# EAGLE design atarimovie (EAGLE 8.7.1)
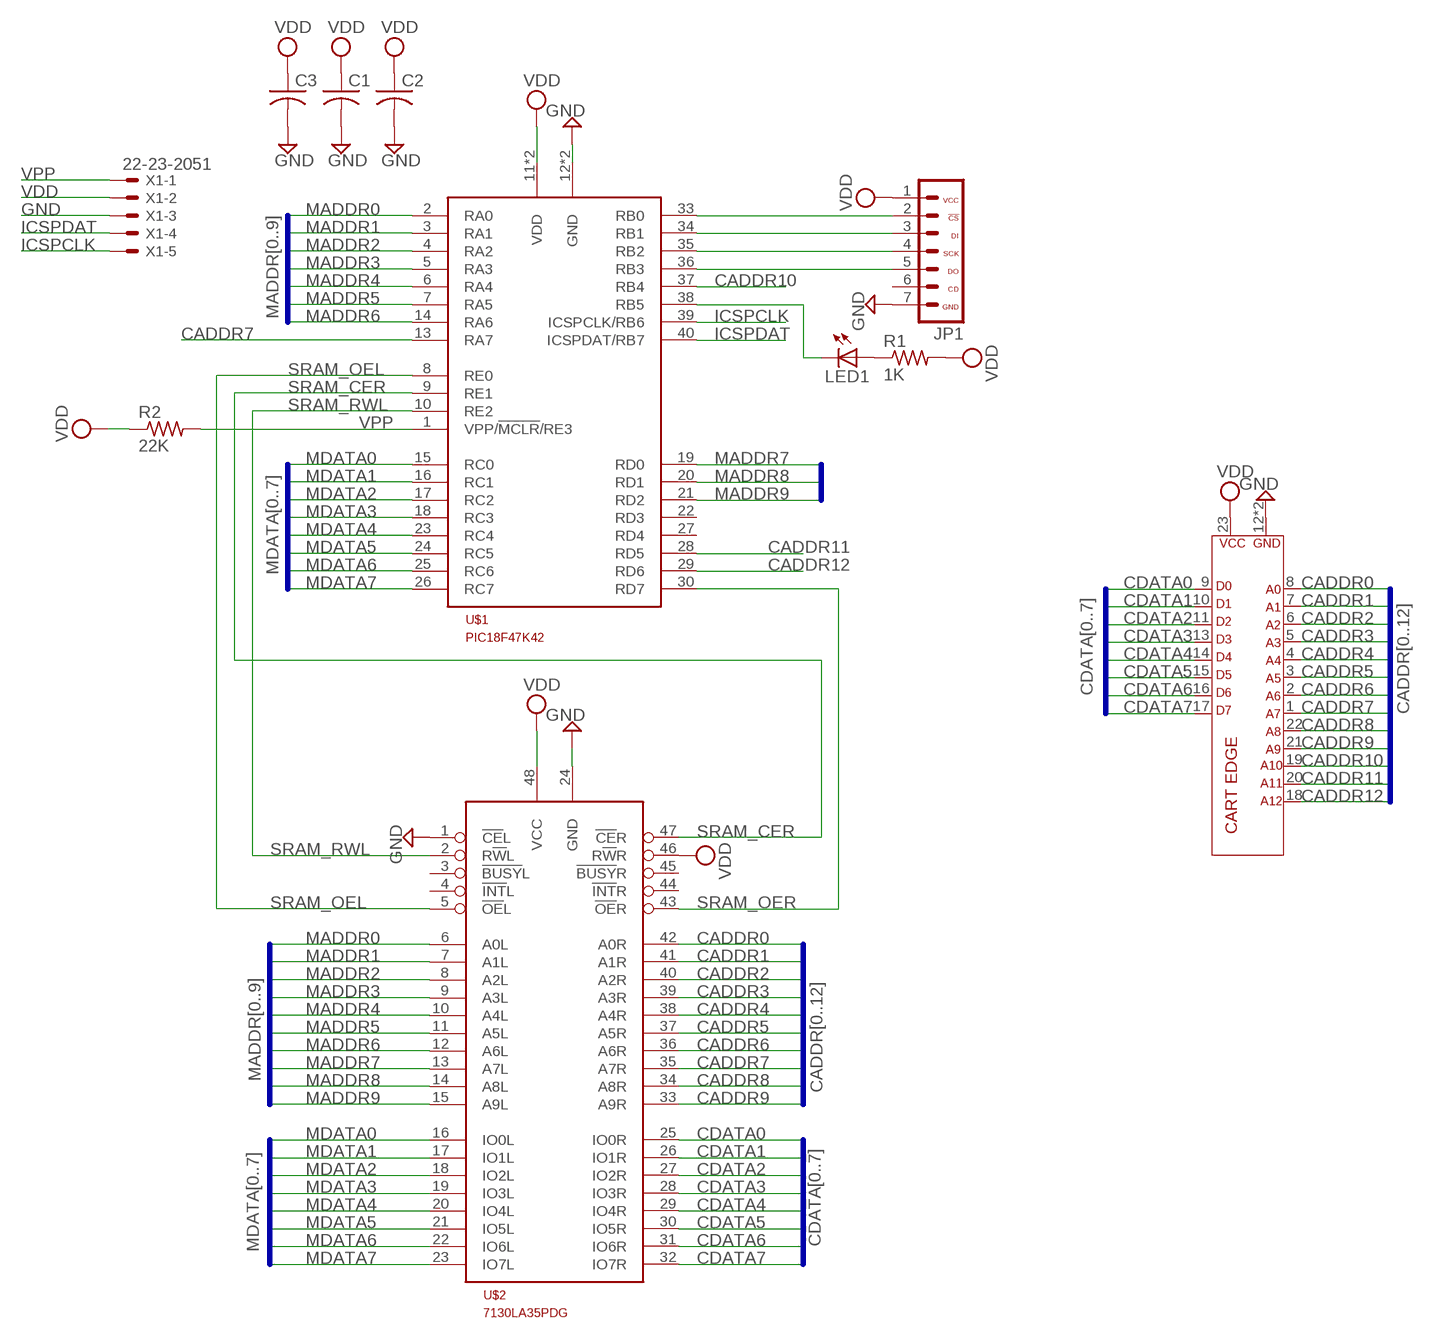
[diagram p0: schematic, sheet 1]

## Parts
C1  C-US050-025X075  [C050-025X075]
C2  C-US050-025X075  [C050-025X075]
C3  C-US050-025X075  [C050-025X075]
J1  ATARI-2600MED_NOHOLE  [MED_NOHOLE]
JP1  USD_SHIFTER  [USD_SHIFTER]
LED1  LED3MM  [LED3MM]
R1  1K  R-US_0204/7  [0204/7]
R2  22K  R-US_0204/7  [0204/7]
U$1  PIC18F47K42  [DIP40]
U$2  7130LA35PDG  [DIP48]
X1  22-23-2051  [22-23-2051]

## Nets
CADDR0: J1.8(A0) U$2.42(A0R)
CADDR1: J1.7(A1) U$2.41(A1R)
CADDR2: J1.6(A2) U$2.40(A2R)
CADDR3: J1.5(A3) U$2.39(A3R)
CADDR4: J1.4(A4) U$2.38(A4R)
CADDR5: J1.3(A5) U$2.37(A5R)
CADDR6: J1.2(A6) U$2.36(A6R)
CADDR7: J1.1(A7) U$1.13(RA7) U$2.35(A7R)
CADDR8: J1.22(A8) U$2.34(A8R)
CADDR9: J1.21(A9) U$2.33(A9R)
CADDR10: J1.19(A10) U$1.37(RB4)
CADDR11: J1.20(A11) U$1.28(RD5)
CADDR12: J1.18(A12) U$1.29(RD6)
CDATA0: J1.9(D0) U$2.25(IO0R)
CDATA1: J1.10(D1) U$2.26(IO1R)
CDATA2: J1.11(D2) U$2.27(IO2R)
CDATA3: J1.13(D3) U$2.28(IO3R)
CDATA4: J1.14(D4) U$2.29(IO4R)
CDATA5: J1.15(D5) U$2.30(IO5R)
CDATA6: J1.16(D6) U$2.31(IO6R)
CDATA7: J1.17(D7) U$2.32(IO7R)
GND: C1.2 C2.2 C3.2 J1.12(GND) J1.24(GND) JP1.7(GND) U$1.12(GND) U$1.31(GND) U$2.1(!CE!L) U$2.24(GND) X1.3
ICSPCLK: U$1.39(ICSPCLK/RB6) X1.5
ICSPDAT: U$1.40(ICSPDAT/RB7) X1.4
MADDR0: U$1.2(RA0) U$2.6(A0L)
MADDR1: U$1.3(RA1) U$2.7(A1L)
MADDR2: U$1.4(RA2) U$2.8(A2L)
MADDR3: U$1.5(RA3) U$2.9(A3L)
MADDR4: U$1.6(RA4) U$2.10(A4L)
MADDR5: U$1.7(RA5) U$2.11(A5L)
MADDR6: U$1.14(RA6) U$2.12(A6L)
MADDR7: U$1.19(RD0) U$2.13(A7L)
MADDR8: U$1.20(RD1) U$2.14(A8L)
MADDR9: U$1.21(RD2) U$2.15(A9L)
MDATA0: U$1.15(RC0) U$2.16(IO0L)
MDATA1: U$1.16(RC1) U$2.17(IO1L)
MDATA2: U$1.17(RC2) U$2.18(IO2L)
MDATA3: U$1.18(RC3) U$2.19(IO3L)
MDATA4: U$1.23(RC4) U$2.20(IO4L)
MDATA5: U$1.24(RC5) U$2.21(IO5L)
MDATA6: U$1.25(RC6) U$2.22(IO6L)
MDATA7: U$1.26(RC7) U$2.23(IO7L)
N$1: JP1.2(!CS) U$1.33(RB0)
N$2: JP1.3(DI) U$1.34(RB1)
N$3: JP1.4(SCK) U$1.35(RB2)
N$4: JP1.5(DO) U$1.36(RB3)
N$10: LED1.A R1.1
N$11: LED1.K(C) U$1.38(RB5)
SRAM_CER: U$1.9(RE1) U$2.47(!CE!R)
SRAM_OEL: U$1.8(RE0) U$2.5(!OE!L)
SRAM_OER: U$1.30(RD7) U$2.43(!OE!R)
SRAM_RWL: U$1.10(RE2) U$2.2(R!W!L)
VDD: C1.1 C2.1 C3.1 J1.23(VCC) JP1.1(VCC) R1.2 R2.1 U$1.11(VDD) U$1.32(VDD) U$2.46(R!W!R) U$2.48(VCC) X1.2
VPP: R2.2 U$1.1(VPP/!MCLR!/RE3) X1.1
Unconnected: JP1.6(CD) U$1.22(RD3) U$1.27(RD4) U$2.3(!BUSY!L) U$2.4(!INT!L) U$2.44(!INT!R) U$2.45(!BUSY!R)

## Buses
CADDR[0..12]
CDATA[0..7]
MDATA[0..7]
MADDR[0..9]

## Library data of the parts
C1-C3 = resistor:C-US: CAPACITOR, American symbol
J1 = a26board:ATARI-2600: Atari 2600 cartridge board
JP1 = sparkfun:USD_SHIFTER: Header 7 Standard 7-pin 0.1" header. Use with straight break away headers (SKU : PRT-00116), right angle break away headers (PRT-00553), swiss pins (PRT-00743), machine pins (PRT-00117), and female headers (PRT-00115). NOTES ON THE VARIANTS LOCK and LOCK_LONGPADS... This footprint was designed to help hold the alignment of a through-hole component (i.e. 7-pin header) while soldering it into place. You may notice that each hole has been shifted either up or down by 0.005 of an inch from it's more standard position (which is usually a perfectly straight line). This slight alteration caused the pins (the squares in the middle) to touch the edges of the holes. Because they are alternating, it causes a "brace" to hold the header in place. 0.005 has proven to be the perfect amount of "off-center" position when using our standard breakaway headers. Although looks a little odd when you look at the bare footprint, once you have a header in there, the alteration is very hard to notice. Also, if you push a header all the way into place, it is covered up entirely on the bottom side. This idea of altering the position of holes to aid alignment will be further integrated into the Sparkfun Library for other footprints. It can help hold any component with 3 or more connection pins.
LED1 = led:LED: LED OSRAM: - CHIPLED LG R971, LG N971, LY N971, LG Q971, LY Q971, LO R971, LY R971 LH N974, LH R974 LS Q976, LO Q976, LY Q976 LO Q996 - Hyper CHIPLED LW Q18S LB Q993, LB Q99A, LB R99A - SideLED LS A670, LO A670, LY A670, LG A670, LP A670 LB A673, LV A673, LT A673, LW A673 LH A674 LY A675 LS A676, LA A676, LO A676, LY A676, LW A676 LS A679, LY A679, LG A679 - Hyper Micro SIDELED® LS Y876, LA Y876, LO Y876, LY Y876 LT Y87S - SmartLED LW L88C, LW L88S LB L89C, LB L89S, LG L890 LS L89K, LO L89K, LY L89K LS L896, LA L896, LO L896, LY L896 - TOPLED LS T670, LO T670, LY T670, LG T670, LP T670 LSG T670, LSP T670, LSY T670, LOP T670, LYG T670 LG T671, LOG T671, LSG T671 LB T673, LV T673, LT T673, LW T673 LH T674 LS T676, LA T676, LO T676, LY T676, LB T676, LH T676, LSB T676, LW T676 LB T67C, LV T67C, LT T67C, LS T67K, LO T67K, LY T67K, LW E67C LS E67B, LA E67B, LO E67B, LY E67B, LB E67C, LV E67C, LT E67C LW T67C LS T679, LY T679, LG T679 LS T770, LO T770, LY T770, LG T770, LP T770 LB T773, LV T773, LT T773, LW T773 LH T774 LS E675, LA E675, LY E675, LS T675 LS T776, LA T776, LO T776, LY T776, LB T776 LHGB T686 LT T68C, LB T68C - Hyper Mini TOPLED® LB M676 - Mini TOPLED Santana® LG M470 LS M47K, LO M47K, LY M47K Source: http://www.osram.convergy.de LUXEON: - LUMILED® LXK2-PW12-R00, LXK2-PW12-S00, LXK2-PW14-U00, LXK2-PW14-V00 LXK2-PM12-R00, LXK2-PM12-S00, LXK2-PM14-U00 LXK2-PE12-Q00, LXK2-PE12-R00, LXK2-PE12-S00, LXK2-PE14-T00, LXK2-PE14-U00 LXK2-PB12-K00, LXK2-PB12-L00, LXK2-PB12-M00, LXK2-PB14-N00, LXK2-PB14-P00, LXK2-PB14-Q00 LXK2-PR12-L00, LXK2-PR12-M00, LXK2-PR14-Q00, LXK2-PR14-R00 LXK2-PD12-Q00, LXK2-PD12-R00, LXK2-PD12-S00 LXK2-PH12-R00, LXK2-PH12-S00 LXK2-PL12-P00, LXK2-PL12-Q00, LXK2-PL12-R00 Source: www.luxeon.com KINGBRIGHT: KA-3528ASYC Source: www.kingbright.com
R1 R2 = rcl:R-US_: RESISTOR, American symbol; SPICEPREFIX: R
U$1 = atari:PIC18F47K42: PIC18F47K42
U$2 = atari:7130LA35PDG: IC SRAM 8KBIT 35NS 48DIP
X1 = con-molex:22-23-2051: .100" (2.54mm) Center Header - 5 Pin; MF: MOLEX; MPN: 22-23-2051; OC_FARNELL: 1462952; OC_NEWARK: 38C9178

## Board
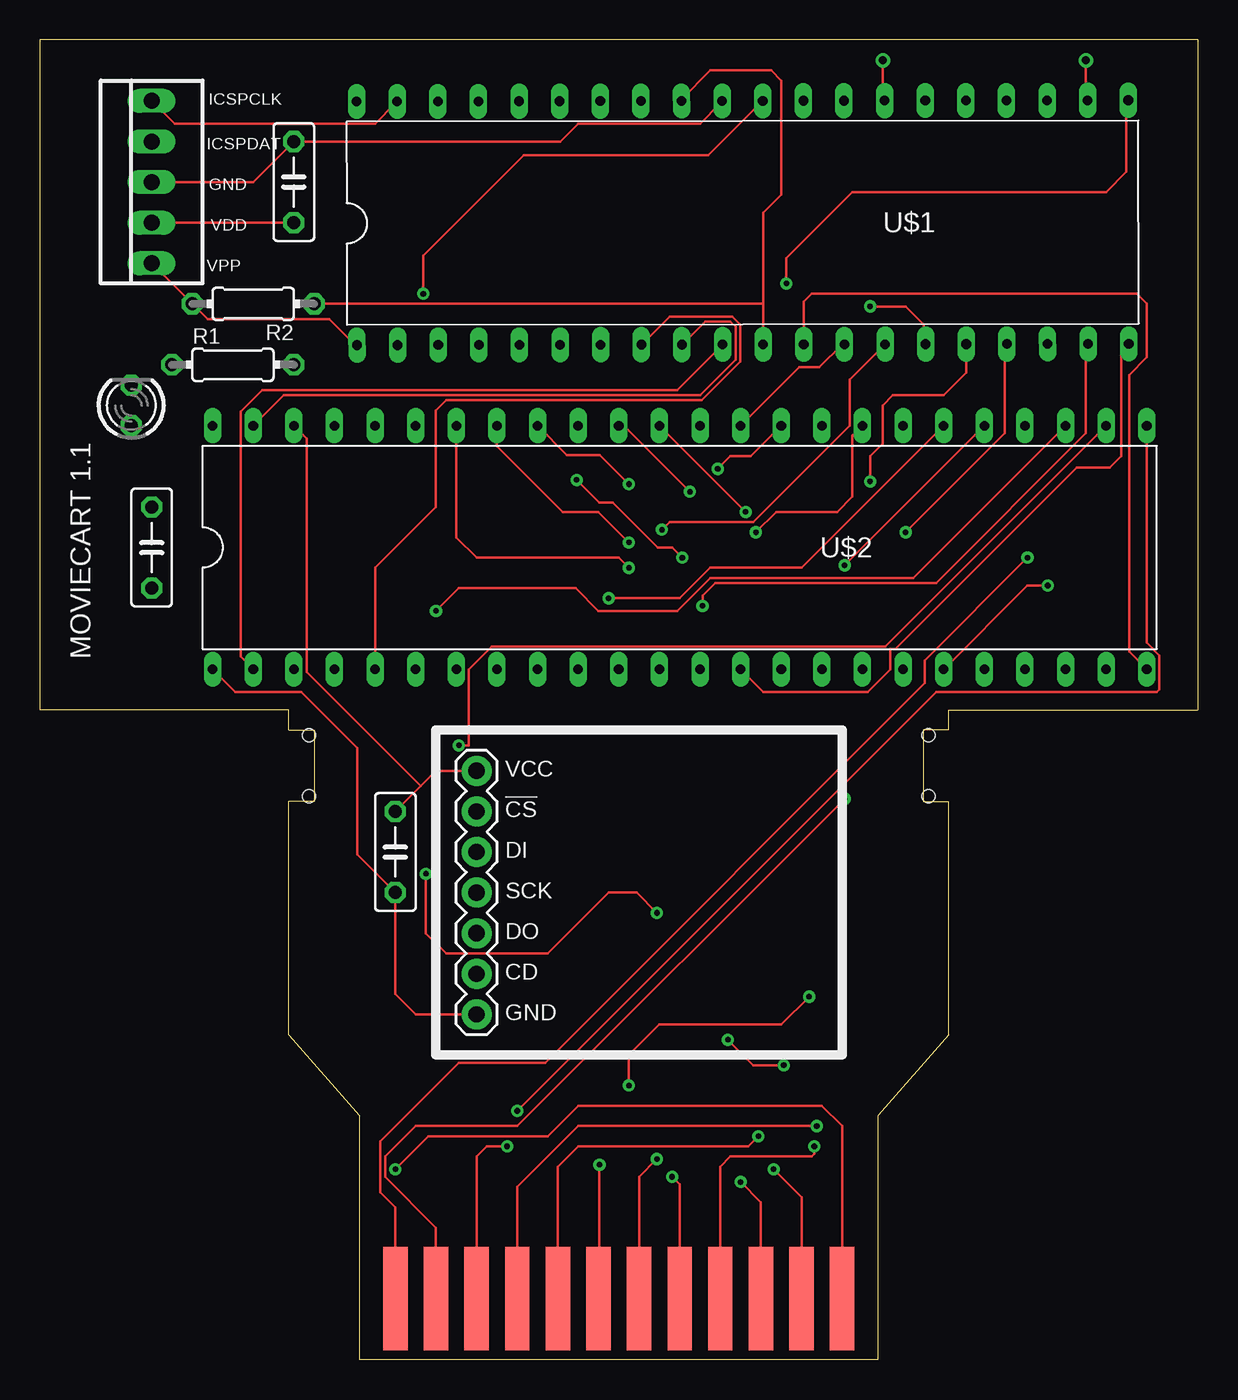
[diagram p1: board, top side]
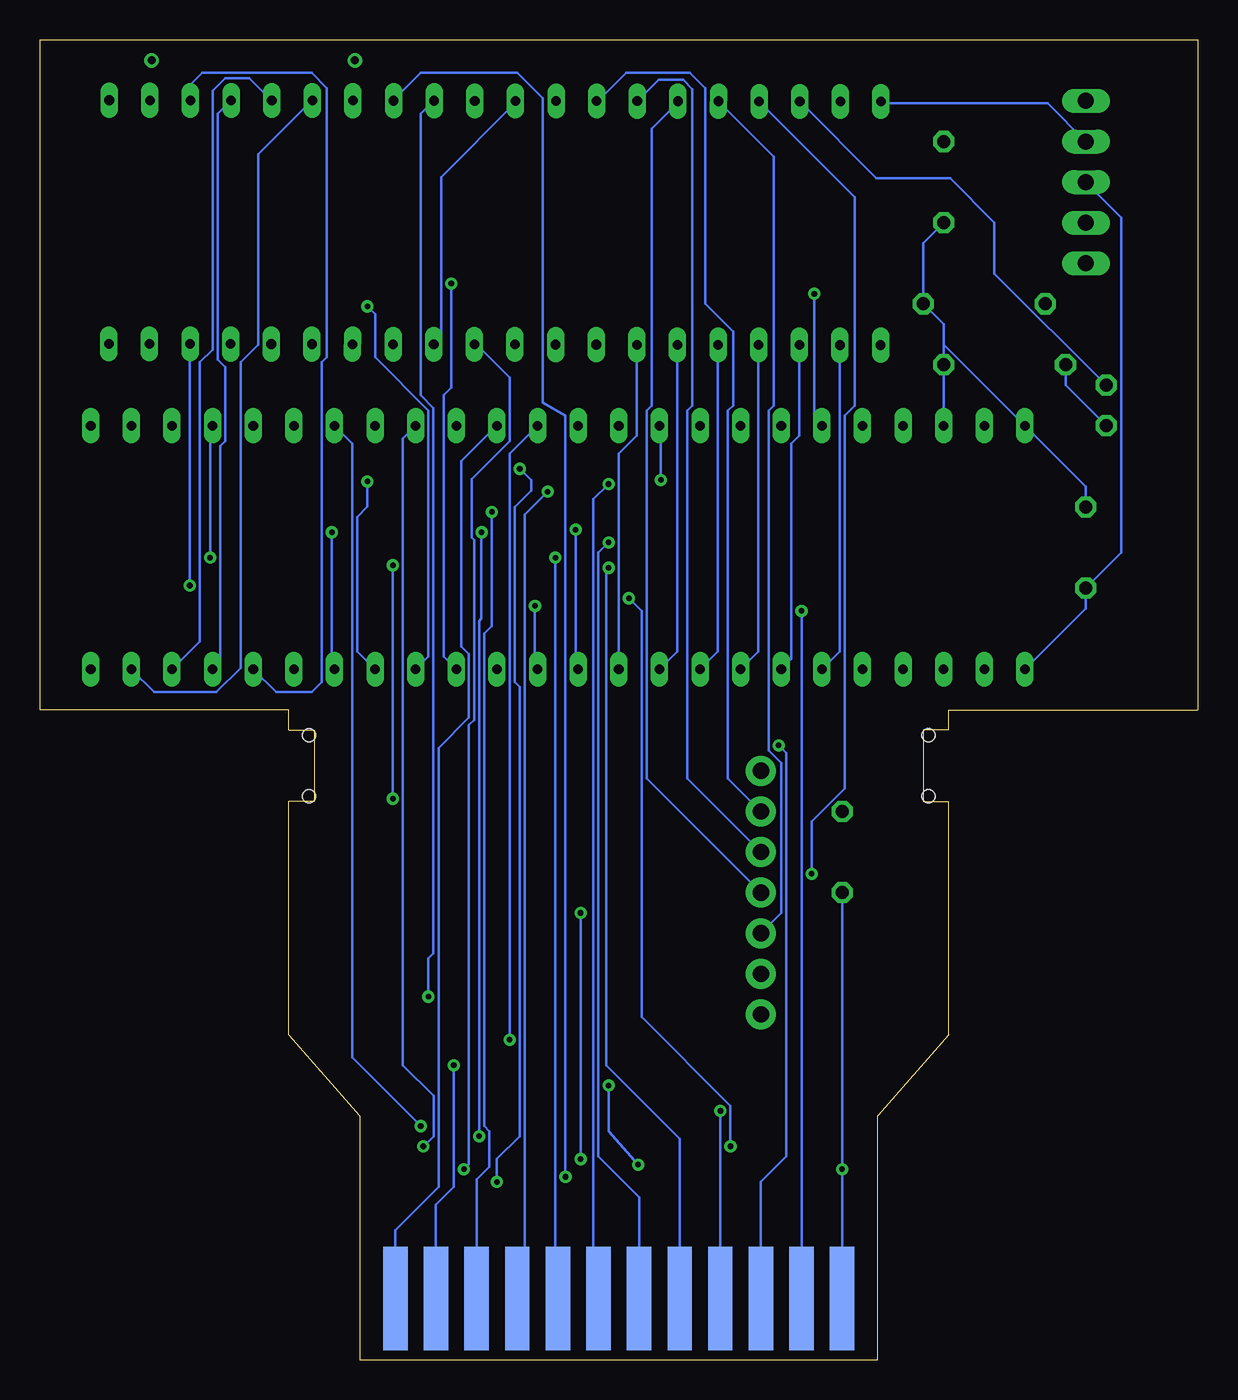
[diagram p2: board, bottom side, seen from below]

Size 72.39 x 82.55 mm. Coordinates in mm from the lower left corner, seen from the top.
Copper layers (1*16): Top 0.035mm / dielectric 1.5mm / Bottom 0.035mm
Design rules "default": minimum track width 6mil, minimum drill 0.35mm, track to track 6mil, track to pad 6mil, pad to pad 6mil, via to via 6mil, smd to smd 6mil, copper to edge 40mil, drill to drill 6mil, minimum pad ring 10mil, minimum via ring 8mil, stop-mask expansion 4mil, vias tented up to drill 0mil, thermal gap 10mil

### Footprints (pad centres in the part's own frame; a part is rotated, then mirrored left to right if it is on the bottom)
C050-025X075 = drill 0.813 octagon: 1 -2.54,0; 2 2.54,0
MED_NOHOLE = smd 1.524 x 6.477: 1 -13.97,-46.99; 2 -11.43,-46.99; 3 -8.89,-46.99; 4 -6.35,-46.99; 5 -3.81,-46.99; 6 -1.27,-46.99; 7 1.27,-46.99; 8 3.81,-46.99; 9 6.35,-46.99; 10 8.89,-46.99; 11 11.43,-46.99; 12 13.97,-46.99 | smd 1.524 x 6.477 bottom: 13 13.97,-46.99; 14 11.43,-46.99; 15 8.89,-46.99; 16 6.35,-46.99; 17 3.81,-46.99; 18 1.27,-46.99; 19 -1.27,-46.99; 20 -3.81,-46.99; 21 -6.35,-46.99; 22 -8.89,-46.99; 23 -11.43,-46.99; 24 -13.97,-46.99 | hole 0.8: -19.367,-11.748; -19.367,-15.557; 19.367,-11.748; 19.367,-15.557
USD_SHIFTER = drill 1.016 pad 1.88: 1 -7.62,-10.16; 2 -5.08,-10.16; 3 -2.54,-10.16; 4 0,-10.16; 5 2.54,-10.16; 6 5.08,-10.16; 7 7.62,-10.16
LED3MM = drill 0.813 octagon: A -1.27,0; K 1.27,0
0204/7 = drill 0.813 octagon: 1 -3.81,0; 2 3.81,0
DIP40 = drill 0.6 long: 1 -7.62,24.13; 2 -7.62,21.59; 3 -7.62,19.05; 4 -7.62,16.51; 5 -7.62,13.97; 6 -7.62,11.43; 7 -7.62,8.89; 8 -7.62,6.35; 9 -7.62,3.81; 10 -7.62,1.27; 11 -7.62,-1.27; 12 -7.62,-3.81; 13 -7.62,-6.35; 14 -7.62,-8.89; 15 -7.62,-11.43; 16 -7.62,-13.97; 17 -7.62,-16.51; 18 -7.62,-19.05; 19 -7.62,-21.59; 20 -7.62,-24.13; 21 7.62,-24.13; 22 7.62,-21.59; 23 7.62,-19.05; 24 7.62,-16.51; 25 7.62,-13.97; 26 7.62,-11.43; 27 7.62,-8.89; 28 7.62,-6.35; 29 7.62,-3.81; 30 7.62,-1.27; 31 7.62,1.27; 32 7.62,3.81; 33 7.62,6.35; 34 7.62,8.89; 35 7.62,11.43; 36 7.62,13.97; 37 7.62,16.51; 38 7.62,19.05; 39 7.62,21.59; 40 7.62,24.13
DIP48 = drill 0.6 long: 1 -7.62,29.21; 2 -7.62,26.67; 3 -7.62,24.13; 4 -7.62,21.59; 5 -7.62,19.05; 6 -7.62,16.51; 7 -7.62,13.97; 8 -7.62,11.43; 9 -7.62,8.89; 10 -7.62,6.35; 11 -7.62,3.81; 12 -7.62,1.27; 13 -7.62,-1.27; 14 -7.62,-3.81; 15 -7.62,-6.35; 16 -7.62,-8.89; 17 -7.62,-11.43; 18 -7.62,-13.97; 19 -7.62,-16.51; 20 -7.62,-19.05; 21 -7.62,-21.59; 22 -7.62,-24.13; 23 -7.62,-26.67; 24 -7.62,-29.21; 25 7.62,-29.21; 26 7.62,-26.67; 27 7.62,-24.13; 28 7.62,-21.59; 29 7.62,-19.05; 30 7.62,-16.51; 31 7.62,-13.97; 32 7.62,-11.43; 33 7.62,-8.89; 34 7.62,-6.35; 35 7.62,-3.81; 36 7.62,-1.27; 37 7.62,1.27; 38 7.62,3.81; 39 7.62,6.35; 40 7.62,8.89; 41 7.62,11.43; 42 7.62,13.97; 43 7.62,16.51; 44 7.62,19.05; 45 7.62,21.59; 46 7.62,24.13; 47 7.62,26.67; 48 7.62,29.21
22-23-2051 = drill 1 long: 1 -5.08,0; 2 -2.54,0; 3 0,0; 4 2.54,0; 5 5.08,0

### Placement (x,y rotation side)
C1  15.88,73.66 90 top
C2  6.99,50.8 270 top
C3  22.23,31.75 270 top
J1  36.2,50.8 0 bottom
JP1  37.47,29.21 270 top
LED1  5.72,59.69 90 top
R1  12.07,62.23 0 top
R2  13.34,66.04 180 top
U$1  43.94,71.12 90.1 top
U$2  40.01,50.8 90 top
X1  6.99,73.66 90 top

### Tracks (layer width: path | path; a pad name or v marks a point on that pad's centre or on a via)
CADDR0  (via drill 0.35)
  Top 0.152: U$2.42 26.04,51.44 27.31,50.16 36.2,50.16 v36.83,49.53
  Bottom 0.152: v36.83,49.53 36.99,49.37 36.99,18.41 32.39,13.81 J1.8
CADDR1  (via drill 0.35)
  Top 0.152: U$2.41 28.58,57.15 32.7,53.02 34.93,53.02 v36.83,51.12
  Bottom 0.152: v36.83,51.12 37.47,50.48 37.47,12.7 34.93,10.16 J1.7
CADDR2  (via drill 0.35)
  Top 0.152: v36.83,54.77 35.02,56.58 32.95,56.58 U$2.40
  Bottom 0.152: v36.83,54.77 37.78,53.82 37.78,4.13 J1.6
CADDR3  (via drill 0.35)
  Top 0.152: v33.56,55.02 34.98,53.6 35.82,53.6 38.62,50.8 39.53,50.8 v40.16,50.16
  Bottom 0.152: v40.16,50.16 40.16,3.97 J1.5 | v33.56,55.02 33.56,58.33 U$2.39
CADDR4  (via drill 0.35)
  Top 0.152: U$2.38 36.51,58.42 v40.64,54.29
  Bottom 0.152: v40.64,54.29 42.07,52.86 42.07,4.29 J1.4
CADDR5  (via drill 0.35)
  Top 0.152: v44.13,53.02 U$2.37
  Bottom 0.152: v44.13,53.02 44.13,45.88 44.61,45.4 44.61,14.61 44.29,14.29 44.29,12.06 45.09,11.27 J1.3
CADDR6  (via drill 0.35)
  Top 0.152: v43.02,20 44.61,18.41 v46.51,18.41
  Bottom 0.152: U$2.36 43.02,56.67 v43.02,20 | v46.51,18.41 46.51,10.79 47.62,9.68 J1.2
CADDR7
  Top 0.152: U$2.35 47.47,62.07 48.74,62.07 50.16,63.5 U$1.13
  Bottom 0.152: U$2.35 46.04,56.2 46.04,44.61 45.56,44.13 45.56,40.16 47.47,38.26 47.47,10.79 50.16,8.1 J1.1
CADDR8  (via drill 0.35)
  Top 0.152: v43.82,11.11 45.09,9.84 J1.22 | v42.39,55.72 43.18,56.52 44.45,56.52 U$2.34
  Bottom 0.152: v43.82,11.11 43.82,12.54 42.39,13.97 42.39,42.07 42.7,42.39 42.7,53.34 41.67,54.37 41.67,55.01 v42.39,55.72
CADDR9  (via drill 0.35)
  Top 0.152: J1.21 42.55,12.06 43.18,12.7 48.26,12.7 48.42,12.86 v48.42,13.34
  Bottom 0.152: U$2.33 49.69,57.63 49.69,18.41 47.77,16.5 47.77,13.97 v48.41,13.34 v48.42,13.34
CADDR10  (via drill 0.35)
  Top 0.152: v38.58,27.94 37.31,29.21 35.56,29.21 31.75,25.4 25.4,25.4 24.13,26.67 v24.13,30.39 | v38.58,12.54 37.47,11.43 J1.19
  Bottom 0.152: v24.13,30.39 24.13,33.66 22.07,35.72 22.07,59.05 21.43,59.69 21.43,72.71 27.31,78.58 U$1.37 | v38.58,12.54 v38.58,27.94
CADDR11  (via drill 0.35)
  Top 0.152: v39.53,11.43 40.01,10.95 J1.20
  Bottom 0.152: v39.53,11.43 39.53,59.05 40.96,59.85 40.96,78.9 42.55,80.49 48.58,80.49 50.16,78.9 U$1.28
CADDR12  (via drill 0.35)
  Top 0.152: J1.18 34.93,4.45 34.99,4.25 v34.99,12.19 | v48.1,22.7 46.36,20.95 38.73,20.95 36.83,19.05 v36.83,17.14
  Bottom 0.152: U$1.29 47.78,78.74 48.58,77.95 48.58,60.33 47.78,59.53 47.78,25.4 48.1,25.08 v48.1,22.7 | v34.99,12.19 36.83,14.29 v36.83,17.14
CDATA0  (via drill 0.35)
  Top 0.152: v29.85,15.56 56.04,41.75 69.85,41.75 70.01,41.91 70.01,44.05 69.22,44.84 U$2.25
  Bottom 0.152: J1.9 v29.85,15.56
CDATA1  (via drill 0.35)
  Top 0.152: U$2.26 52.86,44.61 28.26,44.61 26.83,43.18 26.83,38.42 v26.19,38.42
  Bottom 0.152: v26.19,38.42 25.72,37.94 25.72,12.7 27.31,11.11 J1.10
CDATA2  (via drill 0.35)
  Top 0.152: U$2.27 54.61,48.9 41.91,48.9 39.85,46.83 34.93,46.83 33.5,48.26 26.19,48.26 v24.77,46.83
  Bottom 0.152: J1.11 v24.77,46.83
CDATA3  (via drill 0.35)
  Top 0.152: v61.75,50.16 55.32,43.74 55.32,42.31 31.59,18.57 26.19,18.57 21.29,13.66 21.29,10.46 22.23,9.53 J1.13
  Bottom 0.152: U$2.28 61.75,58.26 v61.75,50.16
CDATA4  (via drill 0.35)
  Top 0.152: v50.32,49.69 U$2.29 | v50.32,35.08 29.85,14.61 23.5,14.61 21.59,12.7 21.59,11.43 24.77,8.26 J1.14
  Bottom 0.152: v50.32,35.08 v50.32,49.69
CDATA5  (via drill 0.35)
  Top 0.152: U$2.30 47.62,49.53 41.91,49.53 40.01,47.62 v35.56,47.62 | v29.21,13.34 27.94,13.34 27.31,12.7 J1.15
  Bottom 0.152: v29.21,13.34 29.21,15.88 34.77,21.43 34.77,46.83 v35.56,47.62
CDATA6  (via drill 0.35)
  Top 0.152: J1.16 29.85,10.79 33.66,14.61 v48.58,14.61
  Bottom 0.152: U$2.31 52.86,57.31 52.86,18.89 v48.58,14.61
CDATA7  (via drill 0.35)
  Top 0.152: v44.77,51.75 46.04,53.02 49.85,53.02 50.8,53.98 50.8,57.78 U$2.32 | v44.93,13.97 44.29,13.34 33.66,13.34 32.39,12.06 J1.17
  Bottom 0.152: v44.77,51.75 44.78,51.66 44.78,46.35 44.93,46.2 44.93,14.02 v44.93,13.97
GND  (via drill 0.35)
  Top 0.152: U$2.24 68.1,44.29 68.1,61.59 69.22,62.71 69.22,66.04 68.58,66.67 48.26,66.67 47.77,66.18 U$1.12 | X1.3 13.34,73.66 C1.2 32.54,76.2 33.66,77.31 41.27,77.31 42.55,78.58 U$1.31 | JP1.7 23.5,21.59 22.23,22.86 C3.2 19.84,31.59 19.84,38.26 16.35,41.75 12.22,41.75 U$2.1 | v22.23,11.91 24.29,13.97 31.75,13.97 33.66,15.88 48.9,15.88 50.16,14.61 J1.24
  Bottom 0.152: U$1.12 47.62,63.66 47.31,63.98 47.31,73.98 42.7,78.58 U$1.31 | U$2.1 6.99,46.99 C2.2 4.76,50.48 4.76,71.44 X1.3 | C3.2 v22.23,11.91 J1.12
ICSPCLK
  Top 0.152: X1.5 8.41,77.31 20.96,77.31 22.23,78.58 U$1.39
ICSPDAT
  Bottom 0.152: U$1.40 19.69,78.58 9.37,78.58 X1.4
MADDR0
  Bottom 0.152: U$2.6 22.38,44.29 22.38,63.34 U$1.2
MADDR1
  Bottom 0.152: U$2.7 25.4,43.81 25.4,57.31 24.92,57.78 24.92,63.34 U$1.3
MADDR2
  Bottom 0.152: U$2.8 27.46,44.29 27.46,63.34 U$1.4
MADDR3
  Bottom 0.152: U$2.9 30,44.29 30,63.34 U$1.5
MADDR4
  Bottom 0.152: U$2.10 32.54,44.29 32.54,63.34 U$1.6
MADDR5
  Bottom 0.152: U$2.11 36.2,56.67 35.08,57.78 35.08,63.34 U$1.7
MADDR6  (via drill 0.35)
  Top 0.152: v38.89,51.91 39.37,52.39 44.61,52.39 50.64,58.42 50.64,61.31 U$1.14
  Bottom 0.152: U$2.12 38.89,43.34 v38.89,51.91
MADDR7  (via drill 0.35)
  Top 0.152: U$1.19 65.41,63.4 65.41,57.94 56.04,48.58 42.23,48.58 41.43,47.78 v41.43,47.15
  Bottom 0.152: U$2.13 41.43,43.34 v41.43,47.15
MADDR8
  Top 0.152: U$2.14 45.24,41.75 51.75,41.75 53.18,43.18 53.18,44.45 53.5,44.45 64.85,55.8 66.91,55.8 67.63,56.52 67.63,63.08 U$1.20
MADDR9  (via drill 0.35)
  Top 0.152: U$1.21 67.94,78.74 67.94,74.3 66.68,73.03 50.8,73.03 46.67,68.9 v46.67,67.31
  Bottom 0.152: U$2.15 47.15,43.97 47.15,60.33 46.67,60.8 v46.67,67.31
MDATA0  (via drill 0.35)
  Top 0.152: U$1.15 55.26,63.47 55.26,64.76 54.13,65.88 v51.91,65.88
  Bottom 0.152: U$2.16 48.1,43.97 48.1,59.37 51.44,62.71 51.44,65.41 v51.91,65.88
MDATA1  (via drill 0.35)
  Top 0.152: v51.91,54.93 51.91,56.52 52.71,57.31 52.71,59.69 53.34,60.33 56.52,60.33 57.93,61.73 U$1.16
  Bottom 0.152: U$2.17 52.56,44.3 52.56,52.7 51.91,53.35 v51.91,54.93
MDATA2  (via drill 0.35)
  Top 0.152: v54.13,51.75 60.33,57.94 60.33,63.39 U$1.17
  Bottom 0.152: U$2.18 54.13,43.34 v54.13,51.75
MDATA3  (via drill 0.35)
  Top 0.152: v63.02,48.42 61.75,48.42 U$2.19
  Bottom 0.152: v63.02,48.42 63.02,63.5 U$1.18
MDATA4
  Bottom 0.152: U$1.23 62.98,79.74 62.23,80.49 55.4,80.49 54.45,79.53 54.45,62.71 54.77,62.39 54.77,42.39 55.4,41.75 57.63,41.75 U$2.20
MDATA5
  Bottom 0.152: U$2.21 61.12,43.66 61.12,57.15 60.8,57.47 60.8,62.07 61.28,62.55 61.28,77.95 60.48,78.74 U$1.24
MDATA6
  Bottom 0.152: U$2.22 62.39,44.93 62.39,62.39 61.59,63.18 61.59,79.38 60.8,80.17 59.3,80.17 U$1.25
MDATA7
  Bottom 0.152: U$1.26 55.4,78.74 58.74,75.41 58.74,63.5 59.85,62.39 59.85,43.27 61.36,41.75 65.25,41.75 U$2.23
N$1
  Bottom 0.152: JP1.2 29.37,36.35 29.37,59.37 29.05,59.69 29.05,64.29 30.8,66.04 30.8,79.53 31.75,80.49 35.72,80.49 37.47,78.74 U$1.33
N$2
  Bottom 0.152: JP1.3 31.91,36.35 31.91,59.37 31.59,59.69 31.59,79.47 32.17,80.06 32.38,80.06 32.39,80.06 33.71,80.06 U$1.34
N$3
  Bottom 0.152: JP1.4 34.45,36.35 34.45,59.37 34.13,59.69 34.13,76.99 32.54,78.58 U$1.35
N$4
  Bottom 0.152: JP1.5 26.04,27.94 26.04,37.31 26.83,38.1 26.83,59.37 26.51,59.69 26.51,75.25 29.85,78.58 U$1.36
N$5  (via drill 0.5)
  Top 0.152: v52.71,81.28 52.71,78.74
N$6  (via drill 0.5)
  Top 0.152: v65.41,81.28 65.41,78.74
N$10
  Bottom 0.152: LED1.A 8.26,60.96 R1.1
N$11
  Bottom 0.152: U$1.38 24.77,78.58 20.08,73.9 15.48,73.9 12.7,71.12 12.7,67.94 LED1.K
SRAM_CER
  Top 0.152: U$2.47 15.24,60.33 41.27,60.33 43.5,62.55 43.5,64.61 43.18,64.93 41.59,64.93 40.16,63.5 U$1.9
SRAM_OEL
  Top 0.152: U$1.8 37.62,63.5 39.37,65.25 43.29,65.25 43.8,64.74 43.8,62.42 41.39,60.01 25.4,60.01 24.77,59.37 24.77,53.34 20.96,49.53 U$2.5
SRAM_OER  (via drill 0.35)
  Top 0.152: v23.97,66.67 23.97,69.06 30.24,75.33 41.78,75.33 U$1.30
  Bottom 0.152: U$2.43 23.97,58.9 v23.97,66.67
SRAM_RWL
  Top 0.152: U$1.10 42.55,63.34 39.85,60.64 13.9,60.64 12.55,59.3 12.55,59.07 12.54,59.05 12.54,43.97 U$2.2
VDD  (via drill 0.35)
  Top 0.152: 23.81,35.88 24.77,36.83 JP1.1 | 23.81,35.88 C3.1 | C1.1 X1.2 | 23.81,35.88 16.67,43.02 16.67,57.63 U$2.46 | 45.24,66.04 45.24,71.75 46.36,72.87 46.36,80.01 45.72,80.64 41.91,80.64 40.12,78.85 U$1.32 | 45.24,66.04 45.24,63.66 U$1.11 | 45.24,66.04 R2.1 | v45.88,11.91 47.62,10.16 J1.23
  Bottom 0.152: C2.1 6.99,54.61 U$2.48 15.88,63.5 | U$2.46 R1.2 15.88,63.5 | 15.88,63.5 15.88,64.77 R2.1 17.15,69.85 C1.1 | U$1.11 45.09,63.5 43.02,61.44 43.02,57.47 45.4,55.09 45.4,51.44 45.24,51.28 45.24,40.01 45.56,39.69 45.56,12.22 v45.88,11.91
VPP
  Top 0.152: U$1.1 19.69,63.5 18.1,65.09 10.48,65.09 R2.2 X1.1

### Text on the board
tPlace: ICSPCLK | ICSPDAT | GND | VDD | VPP | MOVIECART 1.1